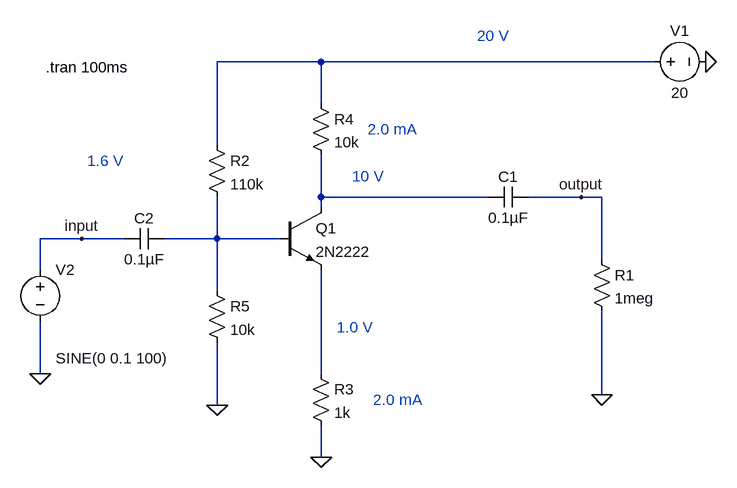
[diagram p0: schematic ClassA-Amplifier-03.asc]
ClassA-Amplifier-03.asc, the LTspice schematic file:
Version 4
SHEET 1 880 680
WIRE 160 -128 0 -128
WIRE 672 -128 160 -128
WIRE 160 -64 160 -128
WIRE 0 0 0 -128
WIRE 160 80 160 16
WIRE 416 80 160 80
WIRE 560 80 480 80
WIRE 592 80 560 80
WIRE 160 96 160 80
WIRE -208 144 -272 144
WIRE -144 144 -208 144
WIRE 0 144 0 80
WIRE 0 144 -80 144
WIRE 96 144 0 144
WIRE 592 176 592 80
WIRE -272 192 -272 144
WIRE 0 224 0 144
WIRE -272 352 -272 272
WIRE 160 352 160 192
WIRE 592 384 592 256
WIRE 0 400 0 304
WIRE 160 480 160 432
FLAG 160 480 0
FLAG 752 -128 0
FLAG -272 352 0
FLAG -208 144 input
FLAG 560 80 output
FLAG 592 384 0
FLAG 0 400 0
SYMBOL res 144 336 R0
SYMATTR InstName R3
SYMATTR Value 1k
SYMBOL res 144 -80 R0
SYMATTR InstName R4
SYMATTR Value 10k
SYMBOL voltage 656 -128 R270
WINDOW 0 32 56 VTop 2
WINDOW 3 -32 56 VBottom 2
WINDOW 123 0 0 Left 2
WINDOW 39 0 0 Left 2
SYMATTR InstName V1
SYMATTR Value 20
SYMBOL voltage -272 176 R0
WINDOW 3 24 152 Left 2
WINDOW 123 24 124 Left 2
WINDOW 39 0 0 Left 2
SYMATTR Value SINE(0 0.1 100)
SYMATTR InstName V2
SYMBOL npn 96 96 R0
SYMATTR InstName Q1
SYMATTR Value 2N2222
SYMBOL cap 480 64 R90
WINDOW 0 0 32 VBottom 2
WINDOW 3 32 32 VTop 2
SYMATTR InstName C1
SYMATTR Value 0.1µF
SYMBOL res 576 160 R0
SYMATTR InstName R1
SYMATTR Value 1meg
SYMBOL cap -80 128 R90
WINDOW 0 0 32 VBottom 2
WINDOW 3 32 32 VTop 2
SYMATTR InstName C2
SYMATTR Value 0.1µF
SYMBOL res -16 -16 R0
SYMATTR InstName R2
SYMATTR Value 110k
SYMBOL res -16 208 R0
SYMATTR InstName R5
SYMATTR Value 10k
TEXT -264 -120 Left 2 !.tran 100ms
TEXT -200 24 Left 2 ;1.6 V
TEXT 184 280 Left 2 ;1.0 V
TEXT 240 392 Left 2 ;2.0 mA
TEXT 232 -24 Left 2 ;2.0 mA
TEXT 400 -168 Left 2 ;20 V
TEXT 208 48 Left 2 ;10 V

The netlist it stands for:
* ClassA-Amplifier-03.asc
R3 N004 0 1k
R4 N001 N002 10k
V1 N001 0 20
V2 input 0 SINE(0 0.1 100)
Q1 N002 N003 N004 0 2N2222
C1 output N002 0.1µF
R1 output 0 1meg
C2 N003 input 0.1µF
R2 N001 N003 110k
R5 N003 0 10k
.model NPN NPN
.model PNP PNP
.lib standard.bjt
.tran 100ms
* 1.6 V
* 1.0 V
* 2.0 mA
* 2.0 mA
* 20 V
* 10 V
.backanno
.end